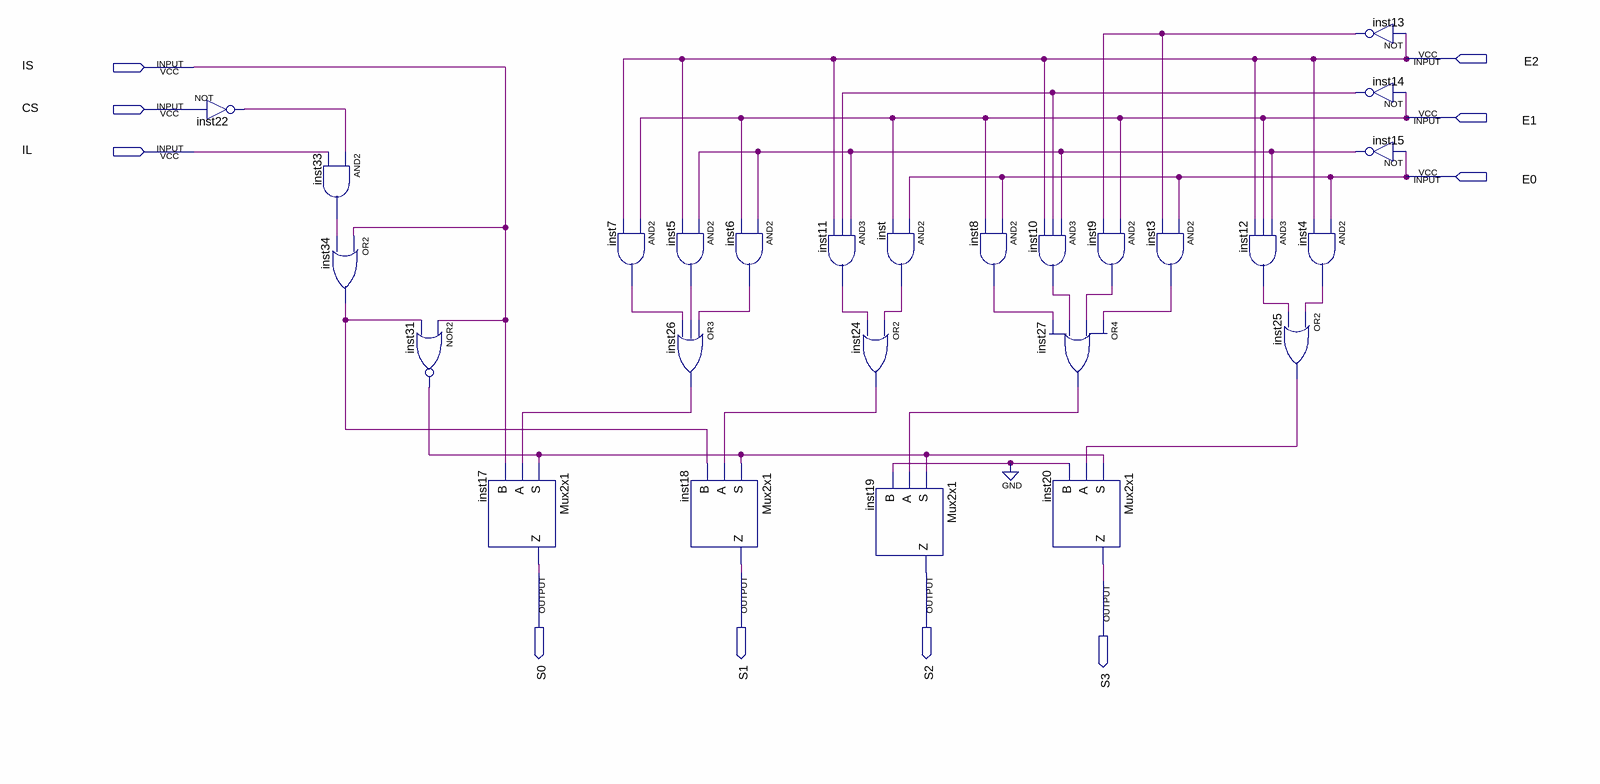
[diagram p0: schematic sheet]
// Quartus schematic EstadoDaMaquina.bdf as structural Verilog: 26 symbols, 10 pins
module EstadoDaMaquina (
  input  E2,
  input  IS,
  input  CS,
  input  E1,
  input  IL,
  input  E0,
  output S0,
  output S1,
  output S2,
  output S3
);

  wire inst3_out, inst4_out, inst5_out, inst6_out, inst7_out, inst8_out, inst9_out, inst10_out, inst11_out,
       inst12_out, inst13_out, inst14_out, inst15_out, inst22_out, inst24_out, inst25_out, inst26_out,
       inst27_out, inst31_out, inst33_out, inst34_out, inst_out;

  not inst22 (inst22_out, CS);
  and inst33 (inst33_out, inst22_out, IL);
  or inst34 (inst34_out, IS, inst33_out);
  nor inst31 (inst31_out, IS, inst34_out);
  Mux2x1 inst17 (.S(inst31_out), .A(inst26_out), .B(IS), .Z(S0));
  and inst7 (inst7_out, E1, E2);
  and inst5 (inst5_out, inst15_out, E2);
  or inst26 (inst26_out, inst6_out, inst5_out, inst7_out);
  Mux2x1 inst18 (.S(inst31_out), .A(inst24_out), .B(inst34_out), .Z(S1));
  and inst6 (inst6_out, inst15_out, E1);
  and inst (inst_out, E0, E1);
  and inst11 (inst11_out, inst15_out, inst14_out, E2);
  or inst24 (inst24_out, inst_out, inst11_out);
  Mux2x1 inst19 (.S(inst31_out), .A(inst27_out), .B(1'b0), .Z(S2));
  and inst8 (inst8_out, E0, E1);
  and inst10 (inst10_out, inst15_out, inst14_out, E2);
  or inst27 (inst27_out, inst3_out, inst9_out, inst10_out, inst8_out);
  Mux2x1 inst20 (.S(inst31_out), .A(inst25_out), .B(1'b0), .Z(S3));
  and inst3 (inst3_out, E0, inst13_out);
  and inst9 (inst9_out, E1, inst13_out);
  and inst12 (inst12_out, inst15_out, E1, E2);
  or inst25 (inst25_out, inst4_out, inst12_out);
  and inst4 (inst4_out, E0, E2);
  not inst13 (inst13_out, E2);
  not inst14 (inst14_out, E1);
  not inst15 (inst15_out, E0);
endmodule
